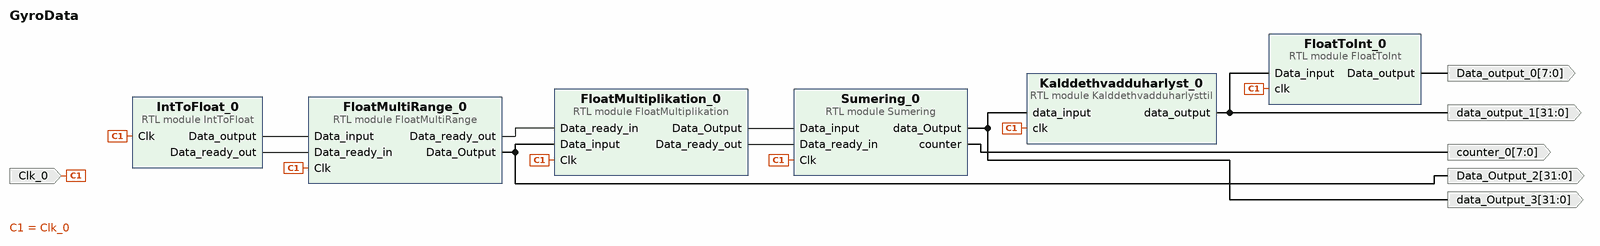
[diagram p0: block diagram of the top level]
# Vivado block design GyroData, xc7a35tcpg236-1, Vivado 2022.2
create_bd_design GyroData

create_bd_port -dir I -type clk Clk_0
create_bd_port -dir O -from 7 -to 0 counter_0
create_bd_port -dir O -from 7 -to 0 Data_output_0
create_bd_port -dir O -from 31 -to 0 data_output_1
create_bd_port -dir O -from 31 -to 0 Data_Output_2
create_bd_port -dir O -from 31 -to 0 data_Output_3

create_bd_cell -type module -reference FloatMultiplikation FloatMultiplikation_0
create_bd_cell -type module -reference FloatMultiRange FloatMultiRange_0
create_bd_cell -type module -reference Kalddethvadduharlysttil Kalddethvadduharlyst_0
create_bd_cell -type module -reference FloatToInt FloatToInt_0
create_bd_cell -type module -reference IntToFloat IntToFloat_0
create_bd_cell -type module -reference Sumering Sumering_0

# ---- connections ----

connect_bd_net -net Clk_0_1 [get_bd_ports Clk_0] \
  [get_bd_pins FloatMultiplikation_0/Clk] [get_bd_pins FloatMultiRange_0/Clk] [get_bd_pins Kalddethvadduharlyst_0/clk] \
  [get_bd_pins FloatToInt_0/clk] [get_bd_pins IntToFloat_0/Clk] [get_bd_pins Sumering_0/Clk]
connect_bd_net [get_bd_pins FloatMultiRange_0/Data_Output] [get_bd_ports Data_Output_2] [get_bd_pins FloatMultiplikation_0/Data_input]
connect_bd_net [get_bd_pins FloatMultiRange_0/Data_ready_out] [get_bd_pins FloatMultiplikation_0/Data_ready_in]
connect_bd_net [get_bd_pins FloatMultiplikation_0/Data_Output] [get_bd_pins Sumering_0/Data_input]
connect_bd_net [get_bd_pins FloatMultiplikation_0/Data_ready_out] [get_bd_pins Sumering_0/Data_ready_in]
connect_bd_net [get_bd_pins FloatToInt_0/Data_output] [get_bd_ports Data_output_0]
connect_bd_net [get_bd_pins IntToFloat_0/Data_output] [get_bd_pins FloatMultiRange_0/Data_input]
connect_bd_net [get_bd_pins IntToFloat_0/Data_ready_out] [get_bd_pins FloatMultiRange_0/Data_ready_in]
connect_bd_net [get_bd_pins Kalddethvadduharlyst_0/data_output] [get_bd_ports data_output_1] [get_bd_pins FloatToInt_0/Data_input]
connect_bd_net [get_bd_pins Sumering_0/counter] [get_bd_ports counter_0]
connect_bd_net [get_bd_pins Sumering_0/data_Output] [get_bd_ports data_Output_3] [get_bd_pins Kalddethvadduharlyst_0/data_input]

validate_bd_design
save_bd_design
